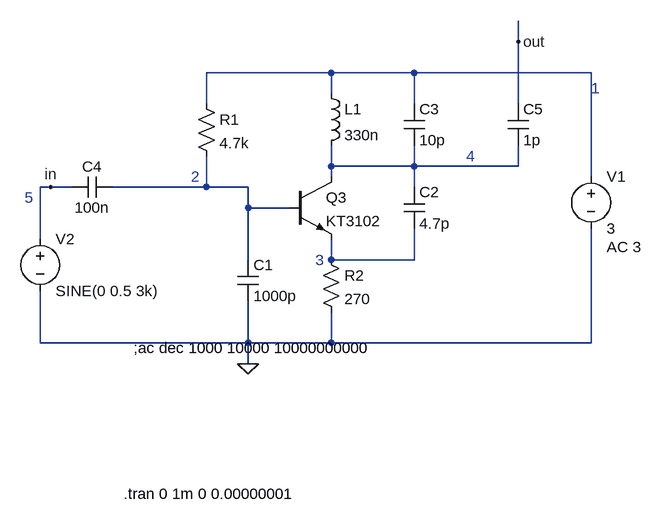
[diagram p0: schematic Draft2kr.asc]
Draft2kr.asc, the LTspice schematic file:
Version 4
SHEET 1 1704 680
WIRE 352 -160 352 -192
WIRE 64 -112 -128 -112
WIRE 192 -112 64 -112
WIRE 464 -112 192 -112
WIRE 64 -80 64 -112
WIRE -128 -64 -128 -112
WIRE 192 -64 192 -112
WIRE 352 -64 352 -160
WIRE 64 32 64 0
WIRE 192 32 192 0
WIRE 192 32 64 32
WIRE 352 32 352 0
WIRE 352 32 192 32
WIRE 64 48 64 32
WIRE 464 48 464 -112
WIRE -368 64 -384 64
WIRE -336 64 -368 64
WIRE -128 64 -128 16
WIRE -128 64 -272 64
WIRE -64 64 -128 64
WIRE 192 64 192 32
WIRE -64 96 -64 64
WIRE 0 96 -64 96
WIRE -384 144 -384 64
WIRE -64 176 -64 96
WIRE 64 176 64 144
WIRE 192 176 192 128
WIRE 192 176 64 176
WIRE -384 304 -384 224
WIRE -64 304 -64 240
WIRE -64 304 -384 304
WIRE 64 304 64 256
WIRE 64 304 -64 304
WIRE 464 304 464 128
WIRE 464 304 64 304
WIRE -64 336 -64 304
FLAG -64 336 0
FLAG 352 -160 out
FLAG -368 64 in
SYMBOL npn 0 48 R0
SYMATTR InstName Q3
SYMATTR Value KT3102
SYMBOL voltage 464 32 R0
WINDOW 123 24 124 Left 2
WINDOW 39 0 0 Left 0
SYMATTR Value2 AC 3
SYMATTR InstName V1
SYMATTR Value 3
SYMBOL cap -80 176 R0
SYMATTR InstName C1
SYMATTR Value 1000p
SYMBOL cap 176 64 R0
SYMATTR InstName C2
SYMATTR Value 4.7p
SYMBOL cap 176 -64 R0
SYMATTR InstName C3
SYMATTR Value 10p
SYMBOL voltage -384 128 R0
WINDOW 123 0 0 Left 0
WINDOW 39 0 0 Left 0
SYMATTR InstName V2
SYMATTR Value SINE(0 0.5 3k)
SYMBOL res -144 -80 R0
SYMATTR InstName R1
SYMATTR Value 4.7k
SYMBOL res 48 160 R0
SYMATTR InstName R2
SYMATTR Value 270
SYMBOL ind 48 -96 R0
SYMATTR InstName L1
SYMATTR Value 330n
SYMBOL cap 336 -64 R0
SYMATTR InstName C5
SYMATTR Value 1p
SYMBOL cap -272 48 R90
WINDOW 0 0 32 VBottom 2
WINDOW 3 32 32 VTop 2
SYMATTR InstName C4
SYMATTR Value 100n
TEXT -256 536 Left 2 !.tran 0 1m 0 0.00000001
TEXT 464 -88 Left 2 ;1
TEXT -152 48 Left 2 ;2
TEXT 40 176 Left 2 ;3
TEXT 272 16 Left 2 ;4
TEXT -240 312 Left 2 !;ac dec 1000 10000 10000000000
TEXT -408 80 Left 2 ;5

The netlist it stands for:
* Draft2kr.asc
Q3 N002 N003 N004 0 KT3102
V1 N001 0 3 AC 3
C1 N003 0 1000p
C2 N002 N004 4.7p
C3 N001 N002 10p
V2 in 0 SINE(0 0.5 3k)
R1 N001 N003 4.7k
R2 N004 0 270
L1 N001 N002 330n
C5 out N002 1p
C4 N003 in 100n
.model NPN NPN
.model PNP PNP
.lib standard.bjt
.tran 0 1m 0 0.00000001
* 1
* 2
* 3
* 4
;ac dec 1000 10000 10000000000
* 5
.backanno
.end